# Altium project paper.PrjPcb
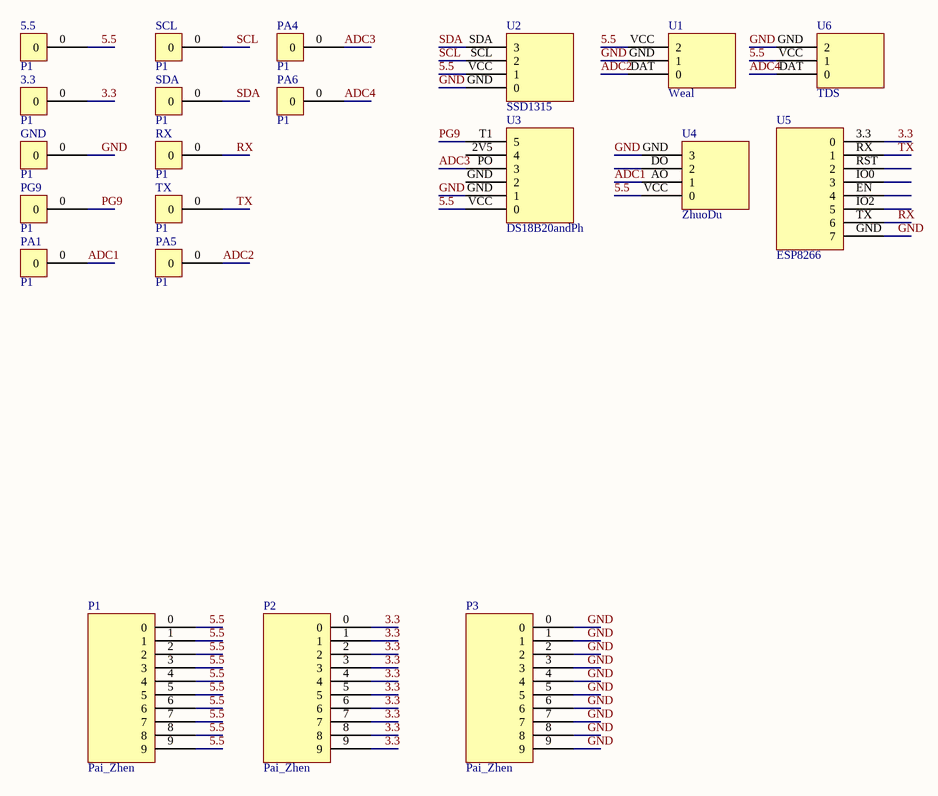
[diagram p0: Sheet1.SchDoc]
1 sheet, 21 parts. Net scope: global (net labels, ports and power ports of the same name join across sheets).
Board file: PCB1.PcbDoc

## Sheet Sheet1.SchDoc
size A4

### Parts
3.3  P1  [PAI_1]
5.5  P1  [PAI_1]
GND  P1  [PAI_1]
P1  Pai_Zhen  [PAI_ZHEN]
P2  Pai_Zhen  [PAI_ZHEN]
P3  Pai_Zhen  [PAI_ZHEN]
PA1  P1  [PAI_1]
PA4  P1  [PAI_1]
PA5  P1  [PAI_1]
PA6  P1  [PAI_1]
PG9  P1  [PAI_1]
RX  P1  [PAI_1]
SCL  P1  [PAI_1]
SDA  P1  [PAI_1]
TX  P1  [PAI_1]
U1  Weal  [Weal]
U2  SSD1315  [ssd1315]
U3  DS18B20andPh  [DS18B20]
U4  ZhuoDu  [ZhuoDu]
U5  ESP8266  [ESP8266]
U6  TDS  [TDS]

### Nets
3.3: 3.3.0 P2.0 P2.1 P2.2 P2.3 P2.4 P2.5 P2.6 P2.7 P2.8 P2.9 U5.3.3(0)
5.5: 5.5.0 P1.0 P1.1 P1.2 P1.3 P1.4 P1.5 P1.6 P1.7 P1.8 P1.9 U1.VCC(2) U2.VCC(1) U3.VCC(0) U4.VCC(0) U6.VCC(1)
ADC1: PA1.0 U4.AO(1)
ADC2: PA5.0 U1.DAT(0)
ADC3: PA4.0 U3.PO(3)
ADC4: PA6.0 U6.DAT(0)
GND: GND.0 P3.0 P3.1 P3.2 P3.3 P3.4 P3.5 P3.6 P3.7 P3.8 P3.9 U1.GND(1) U2.GND(0) U3.GND(1) U4.GND(3) U5.GND(7) U6.GND(2)
PG9: PG9.0 U3.T1(5)
RX: RX.0 U5.TX(6)
SCL: SCL.0 U2.SCL(2)
SDA: SDA.0 U2.SDA(3)
TX: TX.0 U5.RX(1)

Not connected (* = marked no-connect by the designer): U3 2V5(4); U4 DO(2); U5 EN(4) IO0(3) IO2(5) RST(2)